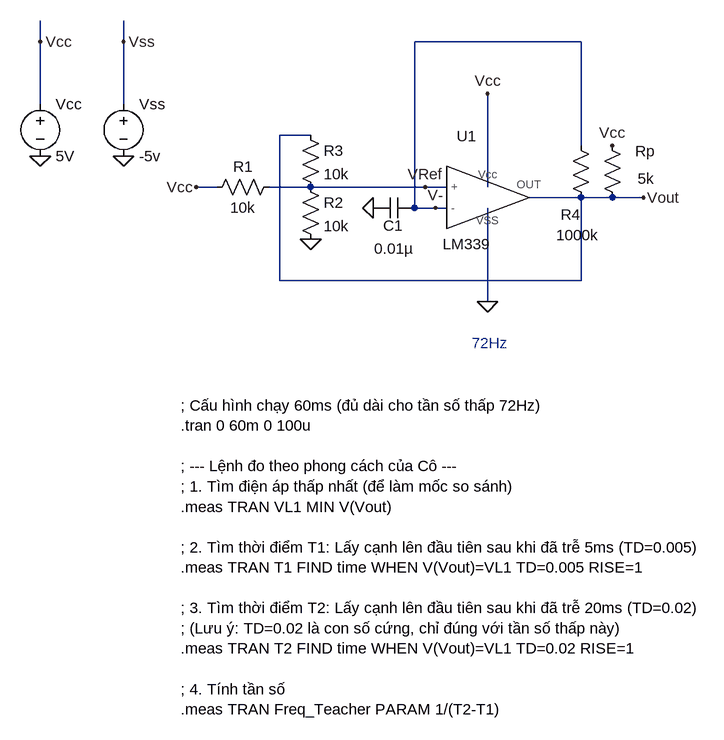
[diagram p0: schematic BAI 5 CHUAN BI 1.asc]
BAI 5 CHUAN BI 1.asc, the LTspice schematic file:
Version 4.1
SHEET 1 2324 984
WIRE -576 -96 -576 -128
WIRE -448 -96 -448 -128
WIRE 256 -96 0 -96
WIRE -576 0 -576 -96
WIRE -448 0 -448 -96
WIRE -160 48 -208 48
WIRE 256 64 256 -96
WIRE -304 128 -336 128
WIRE -160 128 -224 128
WIRE 16 128 -160 128
WIRE 48 128 16 128
WIRE 112 128 112 -16
WIRE 256 144 176 144
WIRE 304 144 256 144
WIRE 352 144 304 144
WIRE 0 160 0 -96
WIRE 32 160 0 160
WIRE 48 160 32 160
WIRE -208 272 -208 48
WIRE 256 272 256 144
WIRE 256 272 -208 272
WIRE 112 304 112 160
FLAG -576 80 0
FLAG 112 304 0
FLAG -160 208 0
FLAG -64 160 0
FLAG 352 144 Vout
FLAG 32 160 V-
FLAG 16 128 VRef
FLAG -576 -96 Vcc
FLAG 112 -16 Vcc
FLAG 304 64 Vcc
FLAG -336 128 Vcc
FLAG -448 80 0
FLAG -448 -96 Vss
SYMBOL LM339 80 144 R0
SYMATTR InstName U1
SYMBOL voltage -576 -16 R0
SYMATTR InstName Vcc
SYMATTR Value 5V
SYMBOL res -208 112 R90
WINDOW 0 0 56 VBottom 2
WINDOW 3 32 56 VTop 2
SYMATTR InstName R1
SYMATTR Value 10k
SYMBOL res -176 112 R0
SYMATTR InstName R2
SYMATTR Value 10k
SYMBOL res -176 32 R0
SYMATTR InstName R3
SYMATTR Value 10k
SYMBOL cap 0 144 R90
WINDOW 0 59 33 VBottom 2
WINDOW 3 63 32 VTop 2
SYMATTR InstName C1
SYMATTR Value 0.01µ
SYMBOL res 240 48 R0
WINDOW 0 -15 122 Left 2
WINDOW 3 -22 154 Left 2
SYMATTR InstName R4
SYMATTR Value 1000k
SYMBOL res 288 48 R0
WINDOW 0 51 25 Left 2
WINDOW 3 55 67 Left 2
SYMATTR InstName Rp
SYMATTR Value 5k
SYMBOL voltage -448 -16 R0
SYMATTR InstName Vss
SYMATTR Value -5v
TEXT -360 464 Left 2 !; Cấu hình chạy 60ms (đủ dài cho tần số thấp 72Hz)\n.tran 0 60m 0 100u\n \n; --- Lệnh đo theo phong cách của Cô ---\n; 1. Tìm điện áp thấp nhất (để làm mốc so sánh)\n.meas TRAN VL1 MIN V(Vout)\n \n; 2. Tìm thời điểm T1: Lấy cạnh lên đầu tiên sau khi đã trễ 5ms (TD=0.005)\n.meas TRAN T1 FIND time WHEN V(Vout)=VL1 TD=0.005 RISE=1\n \n; 3. Tìm thời điểm T2: Lấy cạnh lên đầu tiên sau khi đã trễ 20ms (TD=0.02)\n; (Lưu ý: TD=0.02 là con số cứng, chỉ đúng với tần số thấp này)\n.meas TRAN T2 FIND time WHEN V(Vout)=VL1 TD=0.02 RISE=1\n \n; 4. Tính tần số\n.meas TRAN Freq_Teacher PARAM 1/(T2-T1)
TEXT 88 368 Left 2 ;72Hz

The netlist it stands for:
* BAI 5 CHUAN BI 1.asc
X§U1 VRef V- Vcc 0 Vout LM339  ; pins + - Vcc VSS OUT
Vcc Vcc 0 5V
R1 VRef Vcc 10k
R2 VRef 0 10k
R3 Vout VRef 10k
C1 V- 0 0.01µ
R4 V- Vout 1000k
Rp Vcc Vout 5k
Vss Vss 0 -5v
; Cấu hình chạy 60ms (đủ dài cho tần số thấp 72Hz)
.tran 0 60m 0 100u
; --- Lệnh đo theo phong cách của Cô ---
; 1. Tìm điện áp thấp nhất (để làm mốc so sánh)
.meas TRAN VL1 MIN V(Vout)
; 2. Tìm thời điểm T1: Lấy cạnh lên đầu tiên sau khi đã trễ 5ms (TD=0.005)
.meas TRAN T1 FIND time WHEN V(Vout)=VL1 TD=0.005 RISE=1
; 3. Tìm thời điểm T2: Lấy cạnh lên đầu tiên sau khi đã trễ 20ms (TD=0.02)
; (Lưu ý: TD=0.02 là con số cứng, chỉ đúng với tần số thấp này)
.meas TRAN T2 FIND time WHEN V(Vout)=VL1 TD=0.02 RISE=1
; 4. Tính tần số
.meas TRAN Freq_Teacher PARAM 1/(T2-T1)
* 72Hz
.lib E:\ThiThucHanhCoHa\CoHa\LM339.cir
.backanno
.end